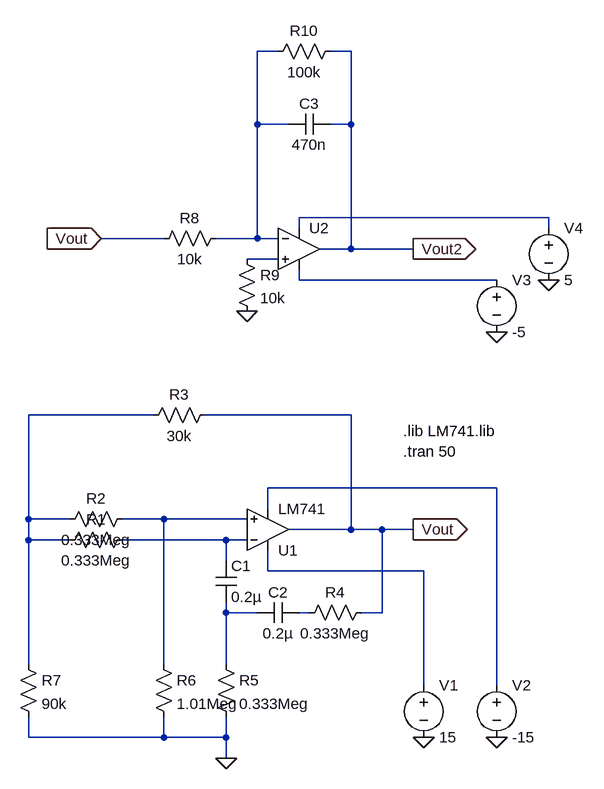
[diagram p0: schematic LFO_square.asc]
LFO_square.asc, the LTspice schematic file:
Version 4
SHEET 1 880 736
WIRE 400 -432 368 -432
WIRE 512 -432 480 -432
WIRE 368 -320 368 -432
WIRE 416 -320 368 -320
WIRE 512 -320 512 -432
WIRE 512 -320 480 -320
WIRE 816 -176 432 -176
WIRE 432 -160 432 -176
WIRE 816 -160 816 -176
WIRE 224 -144 128 -144
WIRE 368 -144 368 -320
WIRE 368 -144 304 -144
WIRE 400 -144 368 -144
WIRE 512 -128 512 -320
WIRE 512 -128 464 -128
WIRE 608 -128 512 -128
WIRE 400 -112 352 -112
WIRE 432 -80 432 -96
WIRE 736 -80 432 -80
WIRE 208 128 16 128
WIRE 512 128 288 128
WIRE 736 240 384 240
WIRE 384 272 384 240
WIRE 16 288 16 128
WIRE 80 288 16 288
WIRE 224 288 160 288
WIRE 352 288 224 288
WIRE 512 304 512 128
WIRE 512 304 416 304
WIRE 560 304 512 304
WIRE 608 304 560 304
WIRE 16 320 16 288
WIRE 80 320 16 320
WIRE 320 320 160 320
WIRE 352 320 320 320
WIRE 320 352 320 320
WIRE 384 368 384 336
WIRE 624 368 384 368
WIRE 320 432 320 416
WIRE 368 432 320 432
WIRE 448 432 432 432
WIRE 560 432 560 304
WIRE 560 432 528 432
WIRE 16 512 16 320
WIRE 224 512 224 288
WIRE 320 512 320 432
WIRE 624 544 624 368
WIRE 736 544 736 240
WIRE 16 624 16 592
WIRE 224 624 224 592
WIRE 224 624 16 624
WIRE 320 624 320 592
WIRE 320 624 224 624
WIRE 320 656 320 624
FLAG 320 656 0
FLAG 736 624 0
FLAG 624 624 0
FLAG 608 304 Vout
IOPIN 608 304 Out
FLAG 608 -128 Vout2
IOPIN 608 -128 Out
FLAG 128 -144 Vout
IOPIN 128 -144 In
FLAG 352 -32 0
FLAG 736 0 0
FLAG 816 -80 0
SYMBOL res 176 304 R90
WINDOW 0 0 56 VBottom 2
WINDOW 3 32 56 VTop 2
SYMATTR InstName R1
SYMATTR Value 0.333Meg
SYMBOL res 176 272 R90
WINDOW 0 0 56 VBottom 2
WINDOW 3 32 56 VTop 2
SYMATTR InstName R2
SYMATTR Value 0.333Meg
SYMBOL res 192 144 R270
WINDOW 0 32 56 VTop 2
WINDOW 3 0 56 VBottom 2
SYMATTR InstName R3
SYMATTR Value 30k
SYMBOL res 432 448 R270
WINDOW 0 32 56 VTop 2
WINDOW 3 0 56 VBottom 2
SYMATTR InstName R4
SYMATTR Value 0.333Meg
SYMBOL res 304 496 R0
SYMATTR InstName R5
SYMATTR Value 0.333Meg
SYMBOL res 208 496 R0
SYMATTR InstName R6
SYMATTR Value 1.01Meg
SYMBOL res 0 496 R0
SYMATTR InstName R7
SYMATTR Value 90k
SYMBOL cap 304 352 R0
SYMATTR InstName C1
SYMATTR Value 0.2µ
SYMBOL cap 432 416 R90
WINDOW 0 0 32 VBottom 2
WINDOW 3 32 32 VTop 2
SYMATTR InstName C2
SYMATTR Value 0.2µ
SYMBOL voltage 624 528 R0
SYMATTR InstName V1
SYMATTR Value 15
SYMBOL voltage 736 528 R0
SYMATTR InstName V2
SYMATTR Value -15
SYMBOL res 320 -160 R90
WINDOW 0 0 56 VBottom 2
WINDOW 3 32 56 VTop 2
SYMATTR InstName R8
SYMATTR Value 10k
SYMBOL cap 480 -336 R90
WINDOW 0 0 32 VBottom 2
WINDOW 3 32 32 VTop 2
SYMATTR InstName C3
SYMATTR Value 470n
SYMBOL Opamps/UniversalOpamp2 432 -128 R0
SYMATTR InstName U2
SYMBOL res 336 -128 R0
SYMATTR InstName R9
SYMATTR Value 10k
SYMBOL res 496 -448 R90
WINDOW 0 0 56 VBottom 2
WINDOW 3 32 56 VTop 2
SYMATTR InstName R10
SYMATTR Value 100k
SYMBOL Opamps/opamp2 384 368 M180
SYMATTR InstName U1
SYMATTR Value LM741
SYMBOL voltage 736 -96 R0
SYMATTR InstName V3
SYMATTR Value -5
SYMBOL voltage 816 -176 R0
SYMATTR InstName V4
SYMATTR Value 5
TEXT 592 184 Left 2 !.tran 50
TEXT 592 152 Left 2 !.lib LM741.lib

The netlist it stands for:
* LFO_square.asc
R1 N008 N005 0.333Meg
R2 N007 N005 0.333Meg
R3 N005 Vout 30k
R4 N011 Vout 0.333Meg
R5 N010 0 0.333Meg
R6 N007 0 1.01Meg
R7 N005 0 90k
C1 N008 N010 0.2µ
C2 N011 N010 0.2µ
V1 N009 0 15
V2 N006 0 -15
R8 N001 Vout 10k
C3 Vout2 N001 470n
XU2 N003 N001 N002 N004 Vout2 level.2 Avol=1Meg GBW=10Meg Slew=10Meg ilimit=25m rail=0 Vos=0 phimargin=45 en=0 enk=0 in=0 ink=0 Rin=500Meg  ; pins IN+ IN- V+ V- OUT
R9 N003 0 10k
R10 Vout2 N001 100k
XU1 N007 N008 N009 N006 Vout LM741  ; pins In+ In- V+ V- OUT
V3 N004 0 -5
V4 N002 0 5
.tran 50
.lib LM741.lib
.lib UniversalOpamps2.sub
.backanno
.end